# Altium schematic sheet ADAU1452KCPZ.SchDoc: =DocumentName
size 420 x 297 mm; CompanyName: "AS Manufacturing" LLC; Organization: "AS Manufacturing" LLC; Address1: 5 Sklyarenka St.; Address2: Kyiv 04073; Address3: Ukraine; Address4: https://ajax.systems/en/; DocumentNumber: 1; SheetNumber: 1; SheetTotal: 6; Template_version: 1.0.1
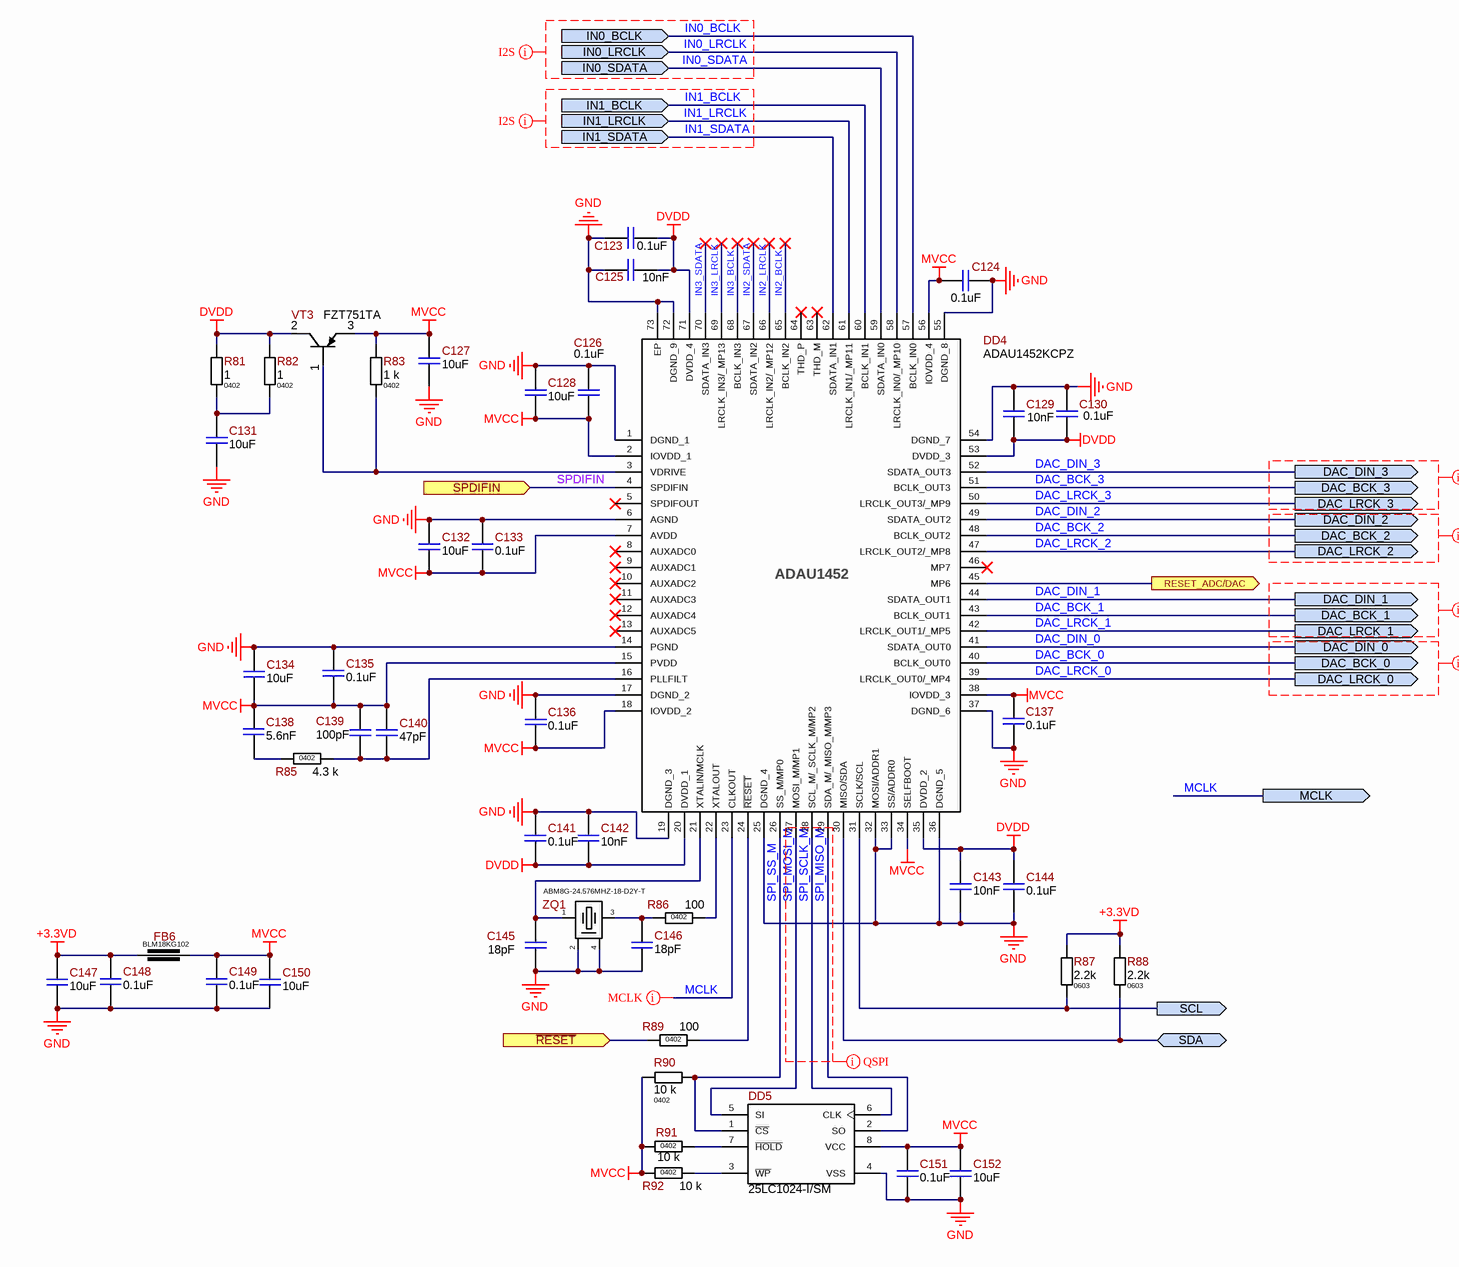
[diagram p0: ADAU1452KCPZ.SchDoc]

## Parts
C123  0.1uF  [C0402(1005)]
C124  0.1uF  [C0402(1005)]
C125  10nF  [C0402(1005)]
C126  0.1uF  [C0402(1005)]
C127  10uF  [C0402(1005)]
C128  10uF  [C0402(1005)]
C129  10nF  [C0402(1005)]
C130  0.1uF  [C0402(1005)]
C131  10uF  [C0402(1005)]
C132  10uF  [C0402(1005)]
C133  0.1uF  [C0402(1005)]
C134  10uF  [C0402(1005)]
C135  0.1uF  [C0402(1005)]
C136  0.1uF  [C0402(1005)]
C137  0.1uF  [C0402(1005)]
C138  5.6nF  [C0402(1005)]
C139  100pF  [C0402(1005)]
C140  47pF  [C0402(1005)]
C141  0.1uF  [C0402(1005)]
C142  10nF  [C0402(1005)]
C143  10nF  [C0402(1005)]
C144  0.1uF  [C0402(1005)]
C145  18pF  [C0402(1005)]
C146  18pF  [C0402(1005)]
C147  10uF  [C0402(1005)]
C148  0.1uF  [C0402(1005)]
C149  0.1uF  [C0402(1005)]
C150  10uF  [C0402(1005)]
C151  0.1uF  [C0402(1005)]
C152  10uF  [C0402(1005)]
DD4  ADAU1452KCPZ  [QFN50P1000X1000X100-73N-D]
DD5  25LC1024-I/SM  [SOIC8]
FB6  BLM18KG102  [BLM18(0603)]
R81  1  Package/Case: 0402  [R0402]
R82  1  Package/Case: 0402  [R0402]
R83  1 k  Package/Case: 0402  [R0402]
R85  4.3 k  Package/Case: 0402  [R0402]
R86  100  Package/Case: 0402  [R0402]
R87  2.2k  Package/Case: 0603  [R0603]
R88  2.2k  Package/Case: 0603  [R0603]
R89  100  Package/Case: 0402  [R0402]
R90  10 k  Package/Case: 0402  [R0402]
R91  10 k  Package/Case: 0402  [R0402]
R92  10 k  Package/Case: 0402  [R0402]
VT3  FZT751TA  [SOT-223]
ZQ1  ABM8G-24.576MHZ-18-D2Y-T  [ABM8]

## Ports
DAC_BCK_0 (out), DAC_BCK_1 (out), DAC_BCK_2 (out), DAC_BCK_3 (out), DAC_DIN_0 (out), DAC_DIN_1 (out), DAC_DIN_2 (out), DAC_DIN_3 (out), DAC_LRCK_0 (out), DAC_LRCK_1 (out), DAC_LRCK_2 (out), DAC_LRCK_3 (out), IN0_BCLK (in), IN0_LRCLK (in), IN0_SDATA (in), IN1_BCLK (in), IN1_LRCLK (in), IN1_SDATA (in), MCLK (out), RESET_ADC/DAC (out), SCL (out), SDA (bidir), SPDIFIN (in), ~{RESET} (in)

## Nets
+3.3VD: C147.2 C148.1 FB6.1 R87.1 R88.1
DVDD: C123.2 C125.2 C129.1 C130.1 C141.2 C142.2 C143.2 C144.2 DD4.20(DVDD_1) DD4.35(DVDD_2) DD4.53(DVDD_3) DD4.71(DVDD_4) R81.1 R82.1 VT3.2(C)
GND: C123.1 C124.2 C125.1 C126.2 C127.1 C128.2 C129.2 C130.2 C131.1 C132.2 C133.2 C134.2 C135.1 C136.2 C137.2 C141.1 C142.1 C143.1 C144.1 C145.1 C146.1 C147.1 C148.2 C149.2 C150.1 C151.1 C152.1 DD4.1(DGND_1) DD4.6(AGND) DD4.14(PGND) DD4.17(DGND_2) DD4.19(DGND_3) DD4.25(DGND_4) DD4.32(MOSI/ADDR1) DD4.33(SS/ADDR0) DD4.36(DGND_5) DD4.37(DGND_6) DD4.54(DGND_7) DD4.55(DGND_8) DD4.72(DGND_9) DD4.73(EP) DD5.4(VSS) ZQ1.2(Body) ZQ1.4(Body)
MVCC: C124.1 C126.1 C127.2 C128.1 C132.1 C133.1 C134.1 C135.2 C136.1 C137.1 C138.1 C139.2 C140.2 C149.1 C150.2 C151.2 C152.2 DD4.2(IOVDD_1) DD4.7(AVDD) DD4.15(PVDD) DD4.18(IOVDD_2) DD4.34(SELFBOOT) DD4.38(IOVDD_3) DD4.56(IOVDD_4) DD5.8(VCC) FB6.2 R83.1 R90.1 R91.2 R92.2 VT3.3(E)
~{RESET}: R89.2 ; port ~{RESET}
DAC_BCK_0: DD4.40(BCLK_OUT0) ; port DAC_BCK_0
DAC_BCK_1: DD4.43(BCLK_OUT1) ; port DAC_BCK_1
DAC_BCK_2: DD4.48(BCLK_OUT2) ; port DAC_BCK_2
DAC_BCK_3: DD4.51(BCLK_OUT3) ; port DAC_BCK_3
DAC_DIN_0: DD4.41(SDATA_OUT0) ; port DAC_DIN_0
DAC_DIN_1: DD4.44(SDATA_OUT1) ; port DAC_DIN_1
DAC_DIN_2: DD4.49(SDATA_OUT2) ; port DAC_DIN_2
DAC_DIN_3: DD4.52(SDATA_OUT3) ; port DAC_DIN_3
DAC_LRCK_0: DD4.39(LRCLK_OUT0/_MP4) ; port DAC_LRCK_0
DAC_LRCK_1: DD4.42(LRCLK_OUT1/_MP5) ; port DAC_LRCK_1
DAC_LRCK_2: DD4.47(LRCLK_OUT2/_MP8) ; port DAC_LRCK_2
DAC_LRCK_3: DD4.50(LRCLK_OUT3/_MP9) ; port DAC_LRCK_3
IN0_BCLK: DD4.57(BCLK_IN0) ; port IN0_BCLK
IN0_LRCLK: DD4.58(LRCLK_IN0/_MP10) ; port IN0_LRCLK
IN0_SDATA: DD4.59(SDATA_IN0) ; port IN0_SDATA
IN1_BCLK: DD4.60(BCLK_IN1) ; port IN1_BCLK
IN1_LRCLK: DD4.61(LRCLK_IN1/_MP11) ; port IN1_LRCLK
IN1_SDATA: DD4.62(SDATA_IN1) ; port IN1_SDATA
IN2_BCLK: DD4.65(BCLK_IN2)
IN2_LRCLK: DD4.66(LRCLK_IN2/_MP12)
IN2_SDATA: DD4.67(SDATA_IN2)
IN3_BCLK: DD4.68(BCLK_IN3)
IN3_LRCLK: DD4.69(LRCLK_IN3/_MP13)
IN3_SDATA: DD4.70(SDATA_IN3)
MCLK: DD4.23(CLKOUT) ; port MCLK
RESET_ADC/DAC: DD4.45(MP6) ; port RESET_ADC/DAC
SCL: DD4.31(SCLK/SCL) R87.2 ; port SCL
SDA: DD4.30(MISO/SDA) R88.2 ; port SDA
SPDIFIN: DD4.4(SPDIFIN) ; port SPDIFIN
SPI_MISO_M: DD4.29(SDA_M/_MISO_M/MP3) DD5.2(SO)
SPI_MOSI_M: DD4.27(MOSI_M/MP1) DD5.5(SI)
SPI_SCLK_M: DD4.28(SCL_M/_SCLK_M/MP2) DD5.6(CLK)
SPI_SS_M: DD4.26(SS_M/MP0) DD5.1(~{CS}) R90.2
NetC131_2: C131.2 R81.2 R82.2
NetC138_2: C138.2 R85.2
NetC139_1: C139.1 C140.1 DD4.16(PLLFILT) R85.1
NetC145_2: C145.2 DD4.21(XTALIN/MCLK) ZQ1.1(X1)
NetC146_2: C146.2 R86.2 ZQ1.3(X2)
NetDD4_3: DD4.3(VDRIVE) R83.2 VT3.1(B)
NetDD4_22: DD4.22(XTALOUT) R86.1
NetDD4_24: DD4.24(~{RESET}) R89.1
NetDD5_3: DD5.3(~{WP}) R92.1
NetDD5_7: DD5.7(~{HOLD}) R91.1

Not connected (* = marked no-connect by the designer): DD4 5(SPDIFOUT)* 8(AUXADC0)* 9(AUXADC1)* 10(AUXADC2)* 11(AUXADC3)* 12(AUXADC4)* 13(AUXADC5)* 46(MP7)* 63(THD_M)* 64(THD_P)*

## Layout directives
net class I2S0: (no net found under the mark)
net class I2S4: IN1_BCLK, IN1_LRCLK, IN1_SDATA
net class I2S5: IN0_BCLK, IN0_LRCLK, IN0_SDATA
net class I2S1: (no net found under the mark)
net class I2S2: (no net found under the mark)
net class QSPI: SPI_MISO_M, SPI_MOSI_M, SPI_SCLK_M
net class MCLK: MCLK
net class I2S3: (no net found under the mark)

## Notes on the sheet
- 1
- 2
- 3
- 4
- 5
- 6
- 7
- 8
- A
- B
- C
- D
- E
- F
- Назва проекту
- Мова
- UA
- Розробник
- Формат
- A3
- Версія
- Дата
- Лист
- /
- (in symbol ADAU1452KCPZ) ADAU1452

## Library data of the parts
C123 C124 C126 C130 C133 C135-C137 C141 C144 C148 C149 C151 = 0.1uF  25V C0403: CAP CER 0.1UF 25V X7R 0603; Manufacturer: Samsung Electro-Mechanics; Name Component: Capacitor Ceramic; Tolerance: ±10%; Operation Temperature: -55°C ~ 125°C; Library Path 1: Capacitors.SchLib; Part Number: 0.1uF  25V C0403; Value: 0.1uF; Temperature Coefficient: X7R; Power (V/A): 25V; Package/Case: C0403; Supplier Part Number 1: 1276-6854-2-ND; ComponentLink1Description: Datasheet
C125 C129 C142 C143 = 10nF  50V C0402: CAP CER 10NF 50V NP0 0603; Manufacturer: AVX Corporation; Name Component: Capacitor Ceramic; Tolerance: ±0.25pF; Operation Temperature: -55°C ~ 105°C; Temperature Coefficient: C0G, NP0; Library Path 1: Capacitors.SchLib; Part Number: 10nF  50V C0402; Value: 10nF; Power (V/A): 50V; Package/Case: C0402; Supplier 1: Digi-key; ComponentLink1Description: Datasheet
C127 C128 C131 C132 C134 C147 C150 C152 = 10uF  6.3V C0402: CAP CER 10UF 6.3V X6S 0402; Manufacturer: Murata Electronics North America; Manufacturer P/N: GRM155C80J106ME11D; Name Component: Capacitor Ceramic; Tolerance: ±20%; Operation Temperature: -55°C ~ 105°C; Library Path 1: Capacitors.SchLib; Part Number: 10uF  6.3V C0402; Value: 10uF; Temperature Coefficient: X6S; Power (V/A): 6.3V; Package/Case: C0402; Supplier 1: Digi-key; Supplier Part Number 1: 490-13233-2-ND; ComponentLink1Description: Datasheet; ComponentLink1URL: https://www.murata.com/~/media/webrenewal/support/library/catalog/products/capacitor/mlcc/c02e.ashx?la=en-us
C138 = 5.6nF  50V C0402: CAP CER 5.6NF 50V NP0 0603; Manufacturer: AVX Corporation; Name Component: Capacitor Ceramic; Tolerance: ±0.25pF; Operation Temperature: -55°C ~ 105°C; Temperature Coefficient: C0G, NP0; Library Path 1: Capacitors.SchLib; Part Number: 5.6nF  50V C0402; Value: 5.6nF; Power (V/A): 50V; Package/Case: C0402; Supplier 1: Digi-key; ComponentLink1Description: Datasheet
C139 = 100pF  50V C0402: CAP CER 100PF 50V NP0 0603; Manufacturer: AVX Corporation; Name Component: Capacitor Ceramic; Tolerance: ±0.25pF; Operation Temperature: -55°C ~ 105°C; Temperature Coefficient: C0G, NP0; Library Path 1: Capacitors.SchLib; Part Number: 100pF  50V C0402; Value: 100pF; Power (V/A): 50V; Package/Case: C0402; Supplier 1: Digi-key; ComponentLink1Description: Datasheet
C140 = 47pF  50V C0402: CAP CER 47PF 50V NP0 0603; Manufacturer: AVX Corporation; Name Component: Capacitor Ceramic; Tolerance: ±0.25pF; Operation Temperature: -55°C ~ 105°C; Temperature Coefficient: C0G, NP0; Library Path 1: Capacitors.SchLib; Part Number: 47pF  50V C0402; Value: 47pF; Power (V/A): 50V; Package/Case: C0402; Supplier 1: Digi-key; ComponentLink1Description: Datasheet
C145 C146 = 18pF  50V C0402: CAP CER 18PF 50V NP0 0603; Manufacturer: AVX Corporation; Name Component: Capacitor Ceramic; Tolerance: ±0.25pF; Operation Temperature: -55°C ~ 105°C; Temperature Coefficient: C0G, NP0; Library Path 1: Capacitors.SchLib; Part Number: 18pF  50V C0402; Value: 18pF; Power (V/A): 50V; Package/Case: C0402; Supplier 1: Digi-key; ComponentLink1Description: Datasheet
DD4 = ADAU1452KCPZ: 300 MHZ 32BIT SIGMADSP AUDIO PRO; Manufacturer: Analog Devices Inc.; Name Component: Digital Signal Processors; Operation Temperature: 0°C ~ 70°C (TA); Power (V/A): ---; Library Path 1: Integrated Circuit.SchLib; Part Number: ADAU1452KCPZ; Value: ADAU1452KCPZ; Package/Case: 72-VFQFN Exposed Pad; Manufacturer P/N: ADAU1452KCPZ; Supplier 1: Digi-key; Supplier Part Number 1: 505-ADAU1452KCPZ-ND; ComponentLink1Description: Datasheet; ComponentLink1URL: https://www.analog.com/media/en/technical-documentation/data-sheets/ADAU1452_1451_1450.pdf
DD5 = 25LC1024-I/SM: EEPROM Memory IC 1Mbit SPI 20 MHz 8-SOIJ; Manufacturer: Microchip Technology; Operation Temperature: -40°C ~ 85°C (TA); Power (V/A): 2.5V ~ 5.5V; Library Path 1: Integrated Circuit.SchLib; Part Number: 25LC1024-I/SM; Name Component: Memory; Value: 25LC1024-I/SM; Package/Case: 8-SOIC; Manufacturer P/N: 25LC1024-I/SM; Supplier 1: Digi-key; Supplier Part Number 1: 25LC1024-I/SM-ND; ComponentLink1Description: Datasheet; ComponentLink1URL: https://ww1.microchip.com/downloads/aemDocuments/documents/MPD/ProductDocuments/DataSheets/25LC1024-1-Mbit-SPI-Bus-Serial-EEPROM-20002064E.pdf
FB6 = BLM18KG102: FERRITE BEAD 1 KOHM 0603 1LN; Manufacturer: Murata Electronics North America; Manufacturer P/N: BLM18KG102SN1D; Name Component: Ferrite Beads; Tolerance: ±25%; Power (V/A): 1A; Library Path 1: Inductance.SchLib; Part Number: BLM18KG102; Value: BLM18KG102; Package/Case: 0603 (1608 Metric); Supplier 1: Digi-key; Supplier Part Number 1: 490-17349-2-ND; ComponentLink1Description: Datasheet; ComponentLink1URL: https://media.digikey.com/pdf/Data%20Sheets/Murata%20PDFs/BLM18yyyyyyN1x.pdf
R81 R82 = 1  R0402: RES SMD 1 OHM  ±1% 1/16W 0402; Part Number: 1  R0402; Power Rating: 0.063W; Name Component: Resistror; Operation Temperature: -55℃ to 155℃; Temperature Coefficient: ±200 ppm/°C; Library Path 1: Resistor.SchLib; Value: 1; Tolerance: ±1%
R83 = 1 k  R0402: RES SMD 1 k OHM  ±1% 1/16W 0402; Power Rating: 0.063W; Name Component: Resistror; Operation Temperature: -55℃ to 155℃; Temperature Coefficient: ±100 ppm/°C; Library Path 1: Resistor.SchLib; Part Number: 1 k  R0402; Value: 1 k; Tolerance: ±1%
R85 = 4.3 k  R0402: RES SMD 4.3 k OHM  ±1% 1/16W 0402; Power Rating: 0.063W; Name Component: Resistror; Operation Temperature: -55℃ to 155℃; Temperature Coefficient: ±100 ppm/°C; Library Path 1: Resistor.SchLib; Part Number: 4.3 k  R0402; Value: 4.3 k; Tolerance: ±1%
R86 R89 = 100  R0402: RES SMD 100 OHM  ±1% 1/16W 0402; Power Rating: 0.063W; Name Component: Resistror; Operation Temperature: -55℃ to 155℃; Temperature Coefficient: ±100 ppm/°C; Library Path 1: Resistor.SchLib; Part Number: 100  R0402; Value: 100; Tolerance: ±1%
R87 R88 = 10 k  R0603: RES SMD 10 k OHM  ±1% 1/10W 0603; Power Rating: 0.1W; Name Component: Resistror; Value: 10 k; Operation Temperature: -55℃ to 155℃; Temperature Coefficient: ±100 ppm/°C; Library Path 1: Resistor.SchLib; Part Number: 10 k  R0603; Tolerance: ±1%
R90-R92 = 10 k  R0402: RES SMD 10 k OHM  ±1% 1/16W 0402; Power Rating: 0.063W; Name Component: Resistror; Operation Temperature: -55℃ to 155℃; Temperature Coefficient: ±100 ppm/°C; Library Path 1: Resistor.SchLib; Part Number: 10 k  R0402; Value: 10 k; Tolerance: ±1%
VT3 = FZT751TA: Bipolar (BJT) Transistor PNP 60 V 3 A 140MHz 2 W Surface Mount SOT-223-3; Manufacturer: Diodes Incorporated; Operation Temperature: -55°C ~ 150°C (TJ); Power Rating: 60V 3A; Library Path 1: Transistors.SchLib; Part Number: FZT751TA; Name Component: Transistor; Value: FZT751TA; Package/Case: SOT-223-3; Manufacturer P/N: FZT751TA; Supplier 1: Digi-key; Supplier Part Number 1: FZT751TR-ND; ComponentLink1Description: Datasheet; ComponentLink1URL: https://www.diodes.com/assets/Datasheets/FZT751.pdf
ZQ1 = ABM8G-24.576MHZ-18-D2Y-T: CRYSTAL 24.5760MHZ 18PF SMD; Manufacturer: Abracon LLC; Manufacturer P/N: 535-10274-2-ND; Name Component: Oscillators; Tolerance: ±20ppm; Operation Temperature: -40°C ~ 85°C; Library Path 1: Resonator.SchLib; Part Number: ABM8G-24.576MHZ-18-D2Y-T; Value: ABM8G-24.576MHZ-18-D2Y-T; Package/Case: SMD; Supplier 1: Kosmodrom; Supplier Part Number 1: 00-00073443